# EAGLE design OP amp shcematic (EAGLE 7.6.0)
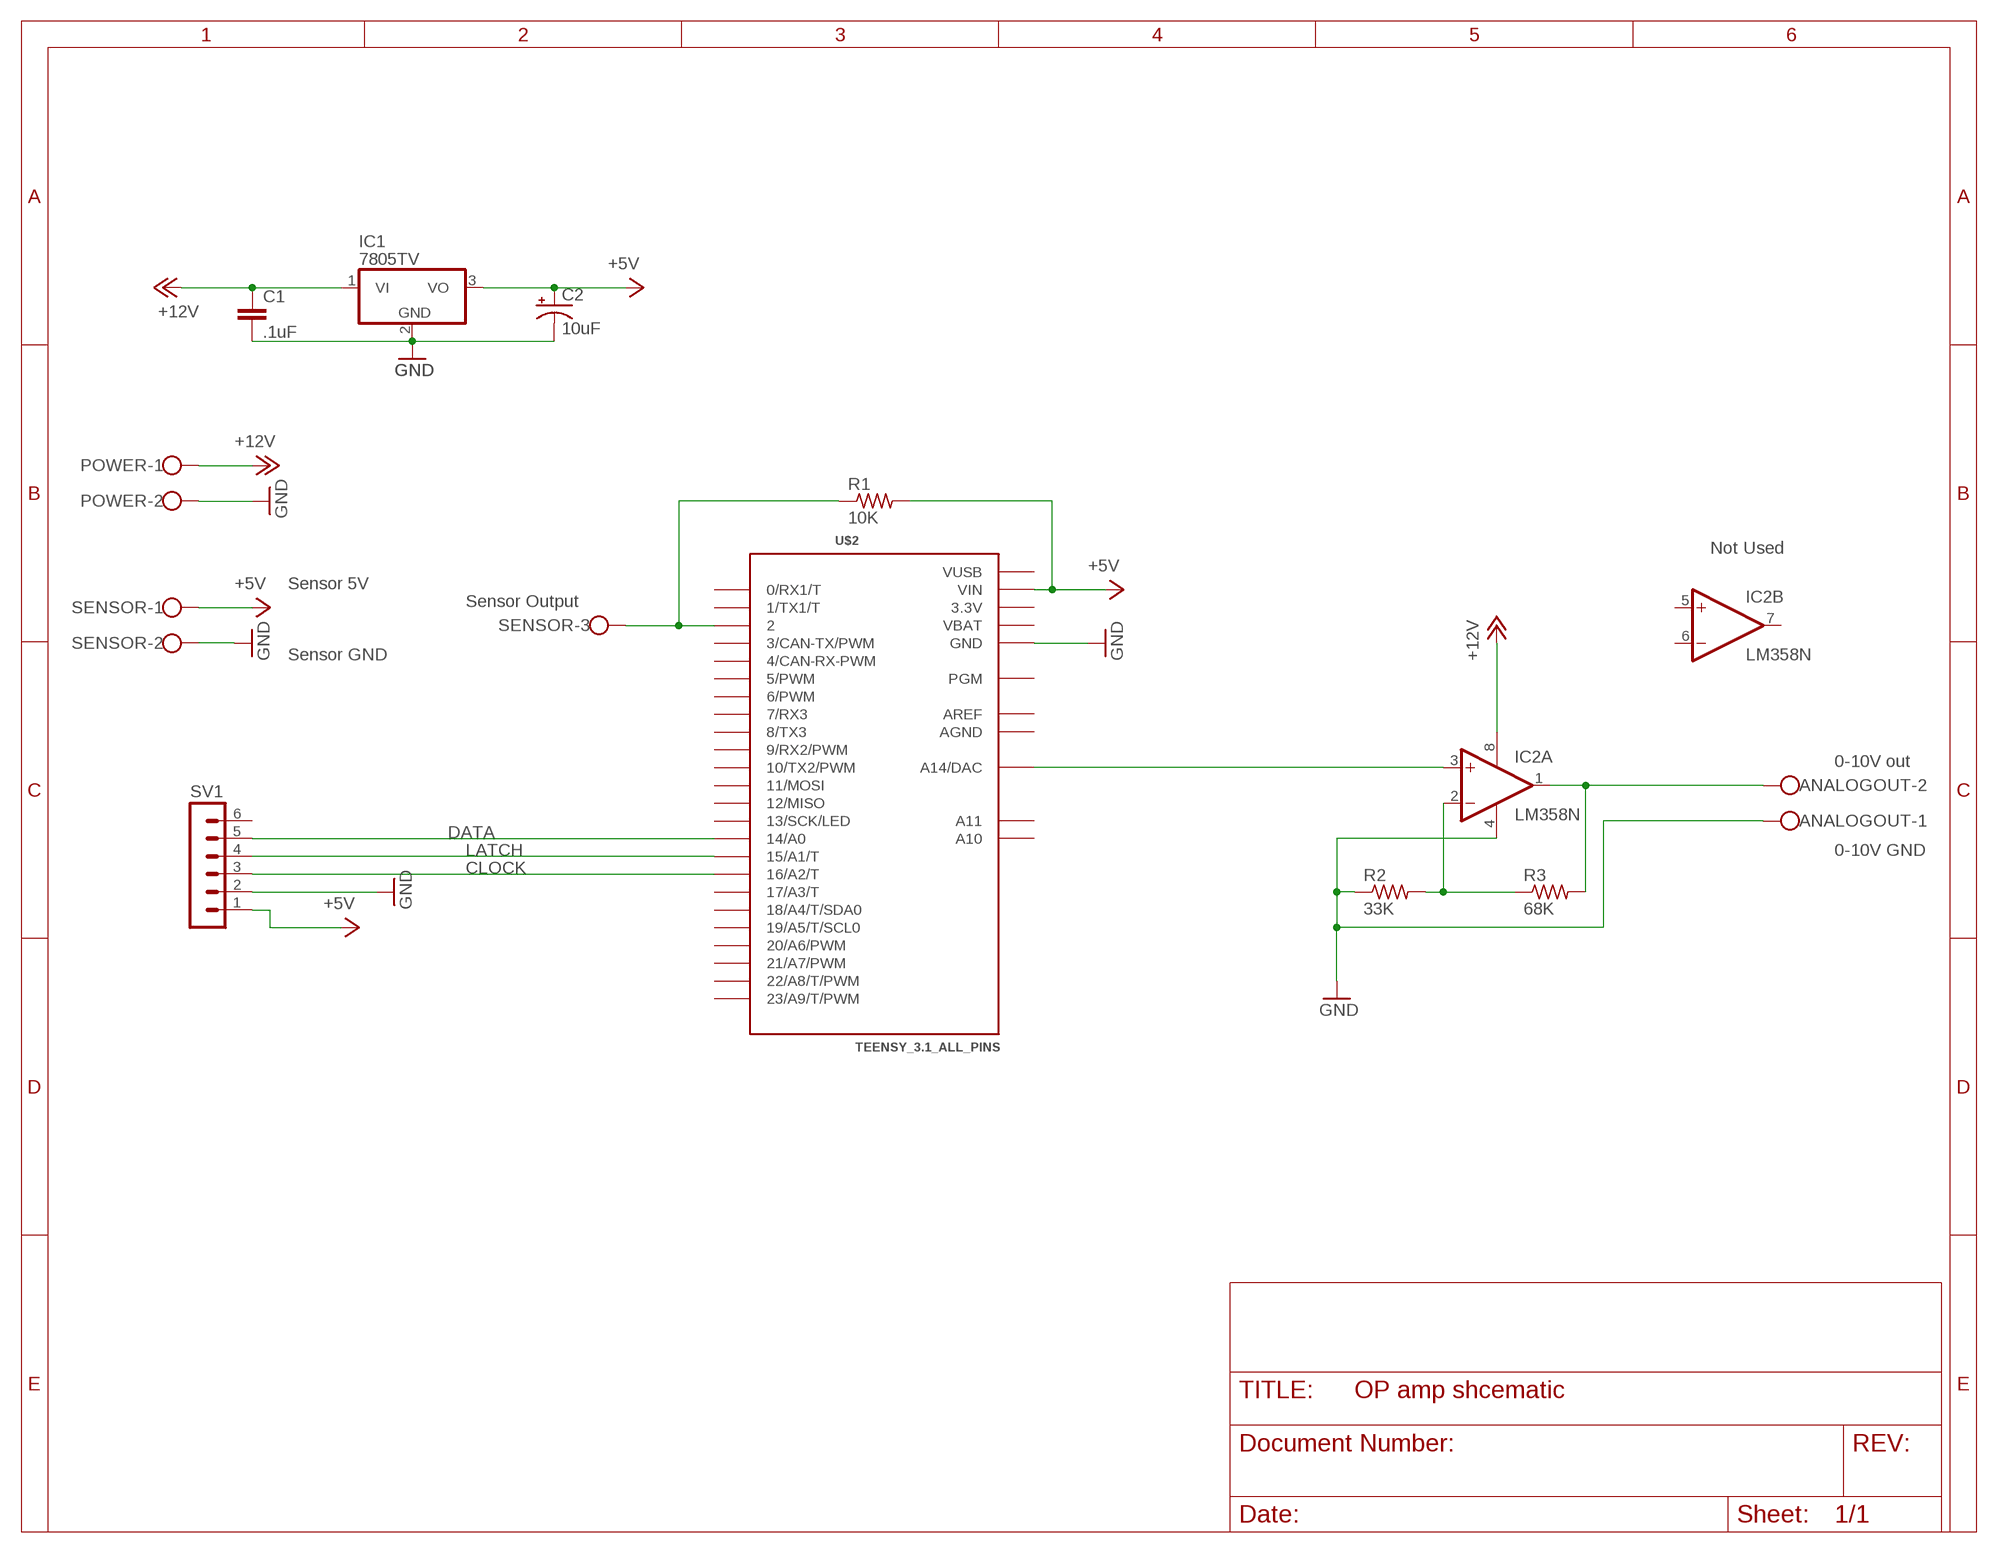
[diagram p0: schematic, sheet 1]

## Parts
ANALOGOUT  W237-102  [W237-102]
C1  .1uF  C2,5-3  [C2.5-3]
C2  10uF  CPOL-USE2-4  [E2-4]
IC1  7805TV  [TO220V]
IC2  LM358N  [DIL08]
POWER  W237-102  [W237-102]
R1  10K  R-US_0309/12  [0309/12]
R2  33K  R-US_0309/12  [0309/12]
R3  68K  R-US_0309/12  [0309/12]
SENSOR  W237-103  [W237-103]
SV1  MA06-1  [MA06-1]
U$2  TEENSY_3.1_ALL_PINS  [TEENSY3-ALL_PINS]

## Nets
+5V: C2.+ IC1.3(VO) R1.2 SENSOR.1 SV1.1 U$2.VIN
+12V: C1.1 IC1.1(VI) IC2.8(P:V+) POWER.1
CLOCK: SV1.3 U$2.16/A2(16/A2/T)
DATA: SV1.5 U$2.14/A0
GND: ANALOGOUT.1 C1.2 C2.- IC1.2(GND) IC2.4(P:V-) POWER.2 R2.1 SENSOR.2 SV1.2 U$2.GND U$2.GND1(GND)
LATCH: SV1.4 U$2.15/A1(15/A1/T)
N$1: IC2.3(A:+IN) U$2.RESET/DAC(A14/DAC)
N$3: ANALOGOUT.2 IC2.1(A:OUT) R3.2
N$4: R1.1 SENSOR.3 U$2.2
N$6: IC2.2(A:-IN) R2.2 R3.1
Unconnected: IC2.5(B:+IN) IC2.6(B:-IN) IC2.7(B:OUT) SV1.6 U$2.0(0/RX1/T) U$2.1(1/TX1/T) U$2.3(3/CAN-TX/PWM) U$2.4(4/CAN-RX-PWM) U$2.5(5/PWM) U$2.6(6/PWM) U$2.7(7/RX3) U$2.8(8/TX3) U$2.9(9/RX2/PWM) U$2.10(10/TX2/PWM) U$2.11(11/MOSI) U$2.12(12/MISO) U$2.13(13/SCK/LED) U$2.17/A3(17/A3/T) U$2.18/A4(18/A4/T/SDA0) U$2.19/A5(19/A5/T/SCL0) U$2.20/A6(20/A6/PWM) U$2.21/A7(21/A7/PWM) U$2.22/A8(22/A8/T/PWM) U$2.23/A9(23/A9/T/PWM) U$2.A10 U$2.A11 U$2.PGM

## Notes on the sheet
- Not Used
- Sensor 5V
- Sensor Output
- Sensor GND
- 0-10V out
- 0-10V GND

## Power pins joined to a net without a drawn wire
3.3V: U$2.3.3V U$2.3.3V1(3.3V)
AGND: U$2.AGND
AREF: U$2.AREF
VBAT: U$2.VBAT
VUSB: U$2.VUSB

## Library data of the parts
ANALOGOUT POWER = con-wago-500:W237-102: WAGO SCREW CLAMP; MPN: 237-102; OC_FARNELL: unknown; OC_NEWARK: 70K9898
C1 = capacitor-wima:C: CAPACITOR naming: grid - package width
C2 = rcl:CPOL-US: POLARIZED CAPACITOR, American symbol
IC1 = linear:78*: Positive VOLTAGE REGULATOR Source: http://cache.national.com/ds/LM/LM78L05.pdf http://www.fairchildsemi.com/ds/LM/LM7805.pdf
IC2 = linear:LM358: OP AMP also LM158; LM258; LM2904 Source: http://cache.national.com/ds/LM/LM158.pdf
R1-R3 = resistor:R-US_: RESISTOR, American symbol
SENSOR = con-wago-500:W237-103: WAGO SCREW CLAMP; MPN: 237-103; OC_FARNELL: unknown; OC_NEWARK: 18M7116
SV1 = con-lstb:MA06-1: PIN HEADER; OC_FARNELL: unknown; OC_NEWARK: unknown
U$2 = Teensy_3_and_LC_Series_Boards_v1.1:TEENSY_3.1_ALL_PINS: Footprint for Teensy 3.1 or 3.2 board using all through-holes, i.e. the entire perimeter plus the 4 through-holes inboard (A10,A11,AREF, VUSB)

## Board
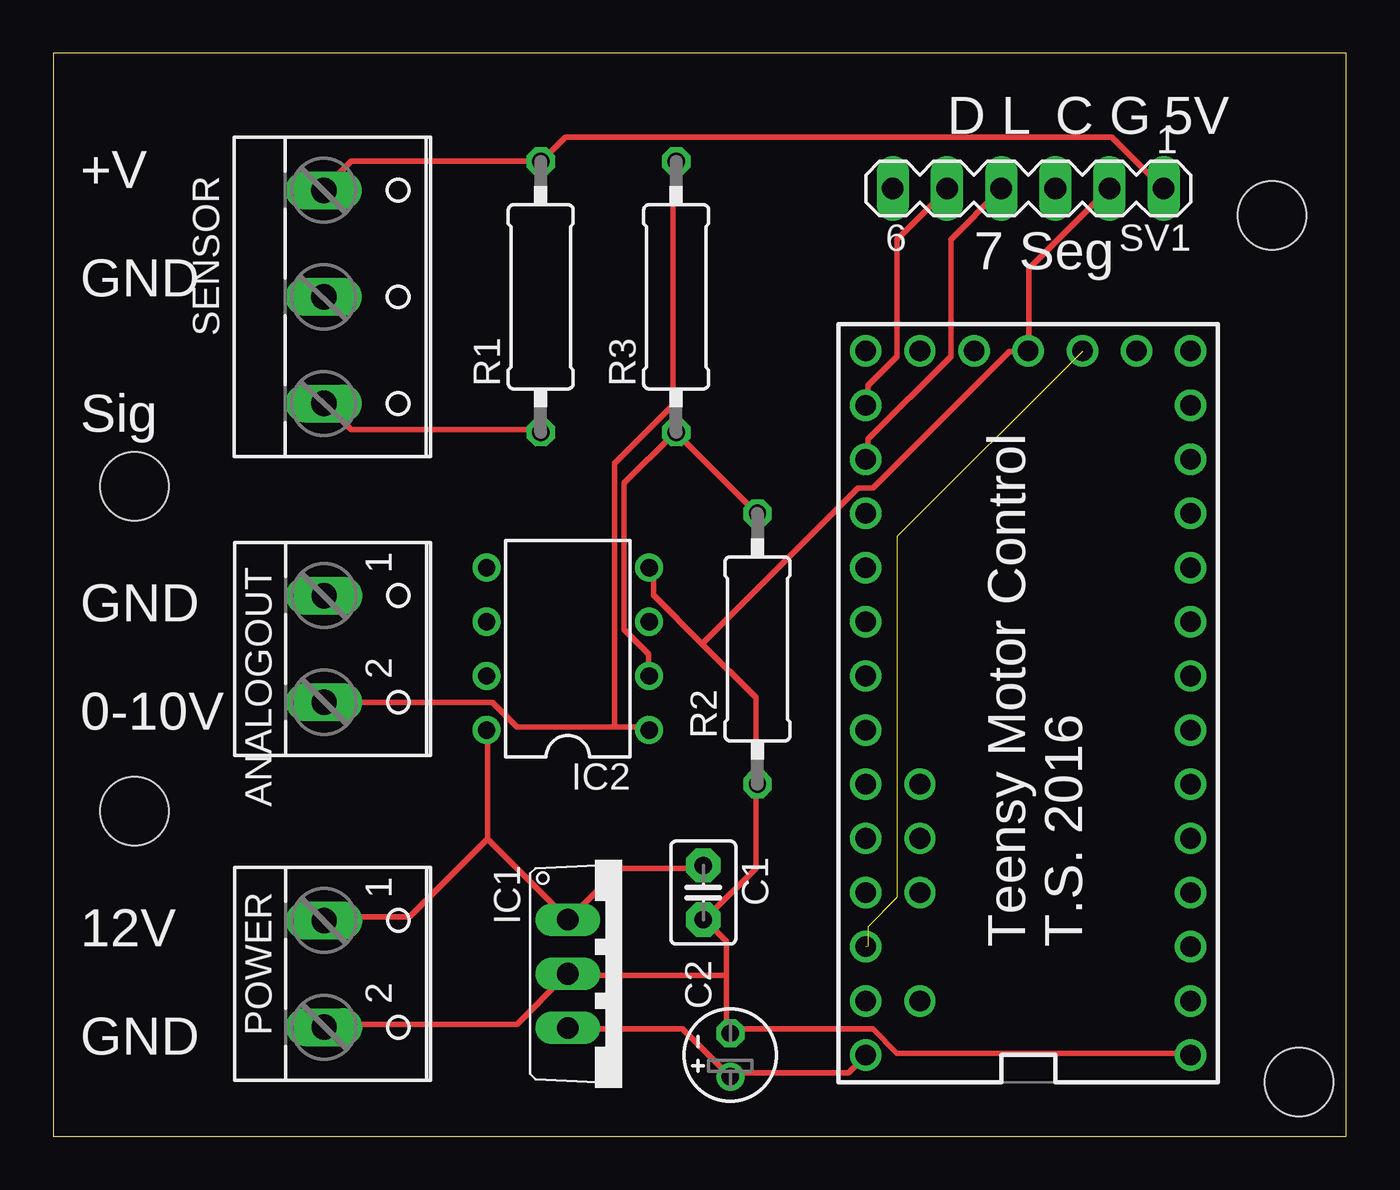
[diagram p1: board, top side]
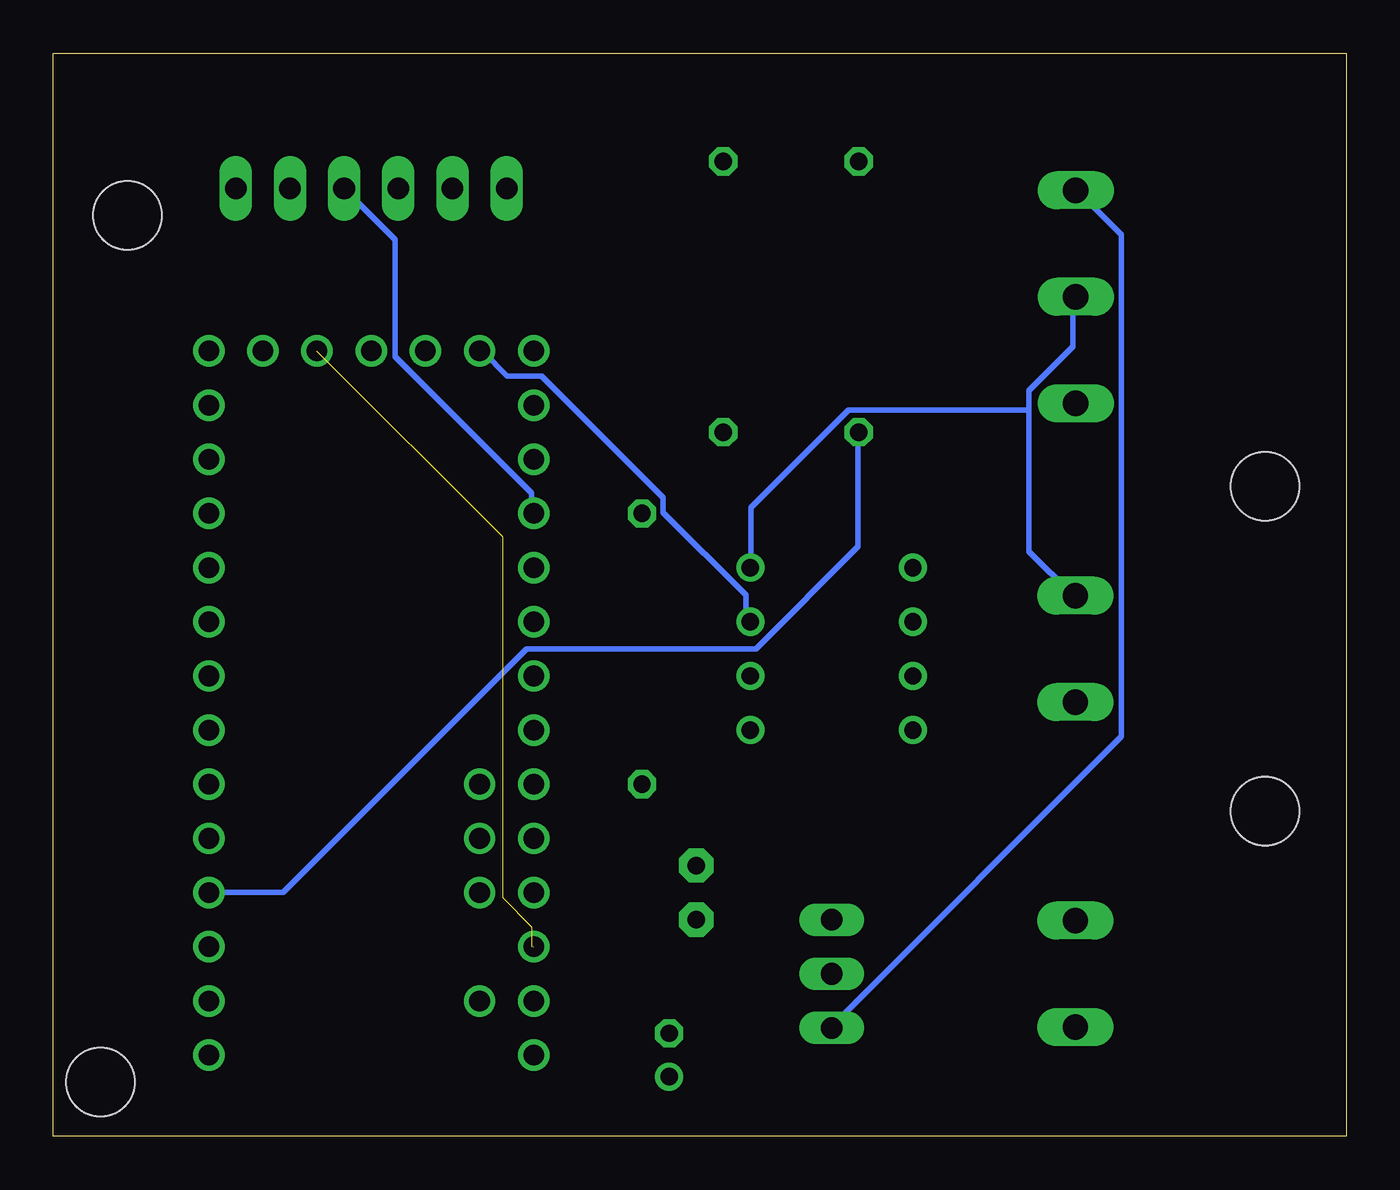
[diagram p2: board, bottom side, seen from below]

Size 60.63 x 50.79 mm. Coordinates in mm from the lower left corner, seen from the top.
Outline: 0,0 60.63,0 60.63,50.79 0,50.79 0,0
Copper layers (1*16): Top 0.035mm / dielectric 1.5mm / Bottom 0.035mm
Design rules "default": minimum track width 10mil, minimum drill 24mil, track to track 8mil, track to pad 8mil, pad to pad 8mil, via to via 8mil, smd to smd 8mil, copper to edge 40mil, drill to drill 8mil, minimum pad ring 10mil, minimum via ring 8mil, stop-mask expansion 4mil, vias tented up to drill 0mil, thermal gap 10mil
Holes 3.2 mm at 57.15,43.18 3.81,15.24 58.42,2.54 3.81,30.48

### Footprints (pad centres in the part's own frame; a part is rotated, then mirrored left to right if it is on the bottom)
W237-102 = drill 1.194 long: 1 -2.5,-1.27; 2 2.5,-1.27
C2.5-3 = drill 0.813 pad 1.6 octagon: 1 -1.27,0; 2 1.27,0
E2-4 = drill 0.813 pad 1.27: + -1.016,0 | drill 0.813 pad 1.27 octagon: - 1.016,0
TO220V = drill 1.016 long: 1 -2.54,-2.54; 2 0,-2.54; 3 2.54,-2.54
DIL08 = drill 0.813 pad 1.27: 1 -3.81,-3.81; 2 -1.27,-3.81; 3 1.27,-3.81; 4 3.81,-3.81; 5 3.81,3.81; 6 1.27,3.81; 7 -1.27,3.81; 8 -3.81,3.81
0309/12 = drill 0.813 octagon: 1 -6.35,0; 2 6.35,0
W237-103 = drill 1.194 long: 1 -5,-1.29; 2 0,-1.29; 3 5,-1.29
MA06-1 = drill 1.016 long: 1 -6.35,0; 2 -3.81,0; 3 -1.27,0; 4 1.27,0; 5 3.81,0; 6 6.35,0
TEENSY3-ALL_PINS = drill 0.965: 0 -7.62,13.97; 1 -7.62,11.43; 2 -7.62,8.89; 3 -7.62,6.35; 3.3V 7.62,11.43; 3.3V1 -2.54,-16.51; 4 -7.62,3.81; 5 -7.62,1.27; 6 -7.62,-1.27; 7 -7.62,-3.81; 8 -7.62,-6.35; 9 -7.62,-8.89; 10 -7.62,-11.43; 11 -7.62,-13.97; 12 -7.62,-16.51; 13 7.62,-16.51; 14/A0 7.62,-13.97; 15/A1 7.62,-11.43; 16/A2 7.62,-8.89; 17/A3 7.62,-6.35; 18/A4 7.62,-3.81; 19/A5 7.62,-1.27; 20/A6 7.62,1.27; 21/A7 7.62,3.81; 22/A8 7.62,6.35; 23/A9 7.62,8.89; A10 5.08,6.35; A11 5.08,3.81; AGND 7.62,13.97; AREF 5.08,8.89; GND -7.62,16.51; GND1 0,-16.51; PGM 2.54,-16.51; RESET/DAC 5.08,-16.51; VBAT -5.08,-16.51; VIN 7.62,16.51; VUSB 5.08,13.97

### Placement (x,y rotation side)
ANALOGOUT  13.97,22.86 270 top
C1  30.48,11.43 270 top
C2  31.75,3.81 90 top
IC1  26.67,7.62 270 top
IC2  24.13,22.86 90 top
POWER  13.97,7.62 270 top
R1  22.86,39.37 90 top
R2  33.02,22.86 90 top
R3  29.21,39.37 90 top
SENSOR  13.97,39.37 270 top
SV1  45.72,44.45 180 top
U$2  45.72,20.32 180 top

### Tracks (layer width: path | path; a pad name or v marks a point on that pad's centre or on a via)
3.3V  (6 unrouted)
+5V
  Top 0.254: U$2.VIN 37.97,3.66 37.29,2.97 31.8,2.97 C2.+ 29.52,5.03 24.26,5.03 IC1.3 | SENSOR.1 12.83,44.58 13.97,45.72 R1.2 22.88,45.72 24.03,46.86 49.63,46.86 51.92,44.58 SV1.1
  Bottom 0.254: IC1.3 24.03,5.26 10.54,18.75 10.54,42.29 12.6,44.35 SENSOR.1
+12V
  Top 0.254: 20.37,13.95 20.37,18.97 IC2.8 | 20.37,13.95 24.03,10.29 IC1.1 26.54,12.57 30.43,12.57 C1.1 | 20.37,13.95 16.71,10.29 12.83,10.29 POWER.1
CLOCK
  Bottom 0.254: SV1.3 44.6,42.06 44.6,36.58 38.2,30.18 38.2,29.26 U$2.16/A2
DATA
  Top 0.254: U$2.14/A0 38.2,34.29 38.2,35.2 39.57,36.58 39.57,42.06 41.86,44.35 SV1.5
GND
  Top 0.254: SV1.2 49.4,44.35 45.74,40.69 45.74,37.03 U$2.GND1 45.52,36.8 44.83,36.8 38.43,30.4 37.74,30.4 30.43,23.09 | 31.57,7.54 31.57,9.14 30.66,10.06 C1.2 30.66,10.29 32.94,12.57 32.94,16.46 R2.1 32.94,16.69 32.94,20.57 30.43,23.09 | 31.57,7.54 31.57,5.03 C2.- 31.8,5.03 38.43,5.03 39.57,3.89 53.29,3.89 U$2.GND | 30.43,23.09 28.14,25.38 28.14,26.52 IC2.4 | 31.57,7.54 24.26,7.54 IC1.2 24.03,7.54 21.74,5.26 12.83,5.26 POWER.2
  Bottom 0.254: 14.88,34.06 14.88,27.43 12.83,25.38 ANALOGOUT.1 | 14.88,34.06 14.88,34.98 12.83,37.03 12.83,39.32 SENSOR.2 | 14.88,34.06 23.34,34.06 27.91,29.49 27.91,26.75 IC2.4
LATCH
  Top 0.254: U$2.15/A1 38.2,31.77 38.2,32.69 42.09,36.58 42.09,42.06 44.37,44.35 SV1.4
N$1
  Bottom 0.254: IC2.3 28.14,24.23 28.14,25.38 32.03,29.26 32.03,29.95 37.74,35.66 39.34,35.66 40.49,36.8 U$2.RESET/DAC
N$3
  Top 0.254: 26.31,19.2 21.74,19.2 20.6,20.34 12.83,20.34 ANALOGOUT.2 | 26.31,19.2 27.91,19.2 IC2.1 | 26.31,19.2 26.31,31.55 29.06,34.29 29.06,45.72 R3.2
N$4
  Top 0.254: R1.1 22.66,33.15 13.97,33.15 12.83,34.29 SENSOR.3
  Bottom 0.254: U$2.2 49.86,11.43 38.43,22.86 27.69,22.86 22.88,27.66 22.88,32.92 R1.1
N$6
  Top 0.254: IC2.2 27.91,21.72 27.91,22.63 26.77,23.77 26.77,30.63 29.06,32.92 R3.1 29.29,32.92 32.94,29.26 R2.2

### Text on the board
tPlace: D | L | C | G | 5V | +V | 7 Seg | GND | Sig | GND | 0-10V | 12V | Teensy Motor Control / T.S. 2016 | GND